# Altium schematic sheet power.SchDoc
size A4
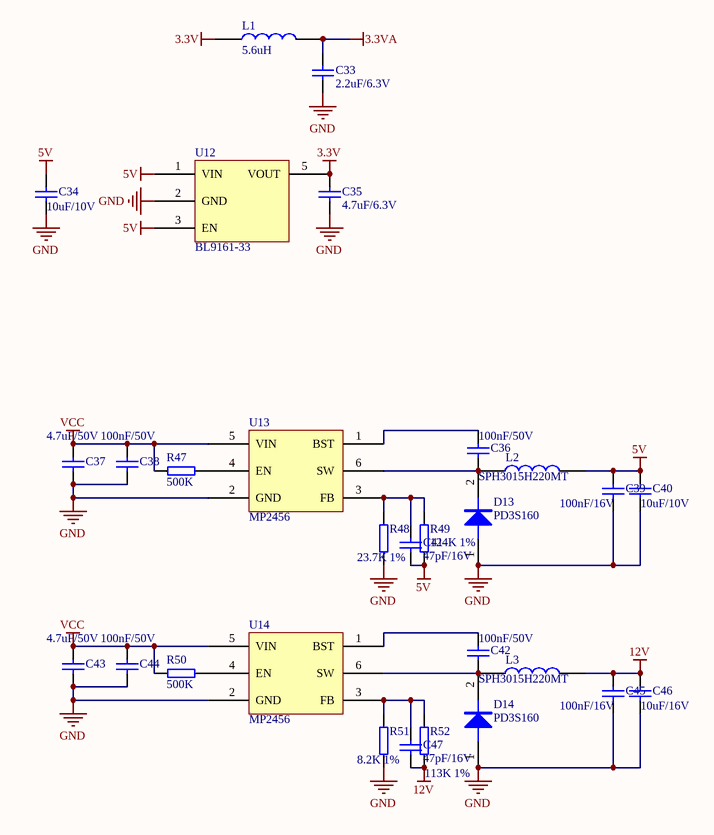
[diagram p0: power.SchDoc]

## Parts
C33  2.2uF/6.3V  [C0402]
C34  10uF/10V  [C0603]
C35  4.7uF/6.3V  [C0603]
C36  100nF/50V  [C0402]
C37  4.7uF/50V  [C0603]
C38  100nF/50V  [C0402]
C39  100nF/16V  [C0402]
C40  10uF/10V  [C0603]
C41  47pF/16V  [C0402]
C42  100nF/50V  [C0402]
C43  4.7uF/50V  [C0603]
C44  100nF/50V  [C0402]
C45  100nF/16V  [C0402]
C46  10uF/16V  [C0805]
C47  47pF/16V  [C0402]
D13  PD3S160  [POWERDI323]
D14  PD3S160  [POWERDI323]
L1  5.6uH  [L0402]
L2  SPH3015H220MT  [SPH3015]
L3  SPH3015H220MT  [SPH3015]
R47  500K  [R0402]
R48  23.7K 1%  [R0402]
R49  124K 1%  [R0402]
R50  500K  [R0402]
R51  8.2K 1%  [R0402]
R52  113K 1%  [R0402]
U12  BL9161-33  [SOT-23(5)]
U13  MP2456  [SOT-23(6)]
U14  MP2456  [SOT-23(6)]

## Nets
3.3V: C35.2 L1.1 U12.5(VOUT)
3.3VA: C33.2 L1.2
5V: C34.2 C39.2 C40.2 C41.2 L2.2 R49.1 U12.1(VIN) U12.3(EN)
12V: C45.2 C46.2 C47.2 L3.2 R52.1
GND: C33.1 C34.1 C35.1 C37.1 C38.1 C39.1 C40.1 C43.1 C44.1 C45.1 C46.1 D13.1(A) D14.1(A) R48.1 R51.1 U12.2(GND) U13.2(GND) U14.2(GND)
VCC: C37.2 C38.2 C43.2 C44.2 R47.1 R50.1 U13.5(VIN) U14.5(VIN)
NetC36_1: C36.1 U13.1(BST)
NetC36_2: C36.2 D13.2(K) L2.1 U13.6(SW)
NetC41_1: C41.1 R48.2 R49.2 U13.3(FB)
NetC42_1: C42.1 U14.1(BST)
NetC42_2: C42.2 D14.2(K) L3.1 U14.6(SW)
NetC47_1: C47.1 R51.2 R52.2 U14.3(FB)
NetR47_2: R47.2 U13.4(EN)
NetR50_2: R50.2 U14.4(EN)

## Library data of the parts
C33-C47 = cap
D13 D14 = DIODE
L1 = INDUCTOR: 贴片电感
L2 L3 = INDUCTOR: 顺络 22uH
R47-R52 = Resistance
U12 = BL9161